# Altium schematic sheet LTC6803.SchDoc
size A; SheetNumber: 4
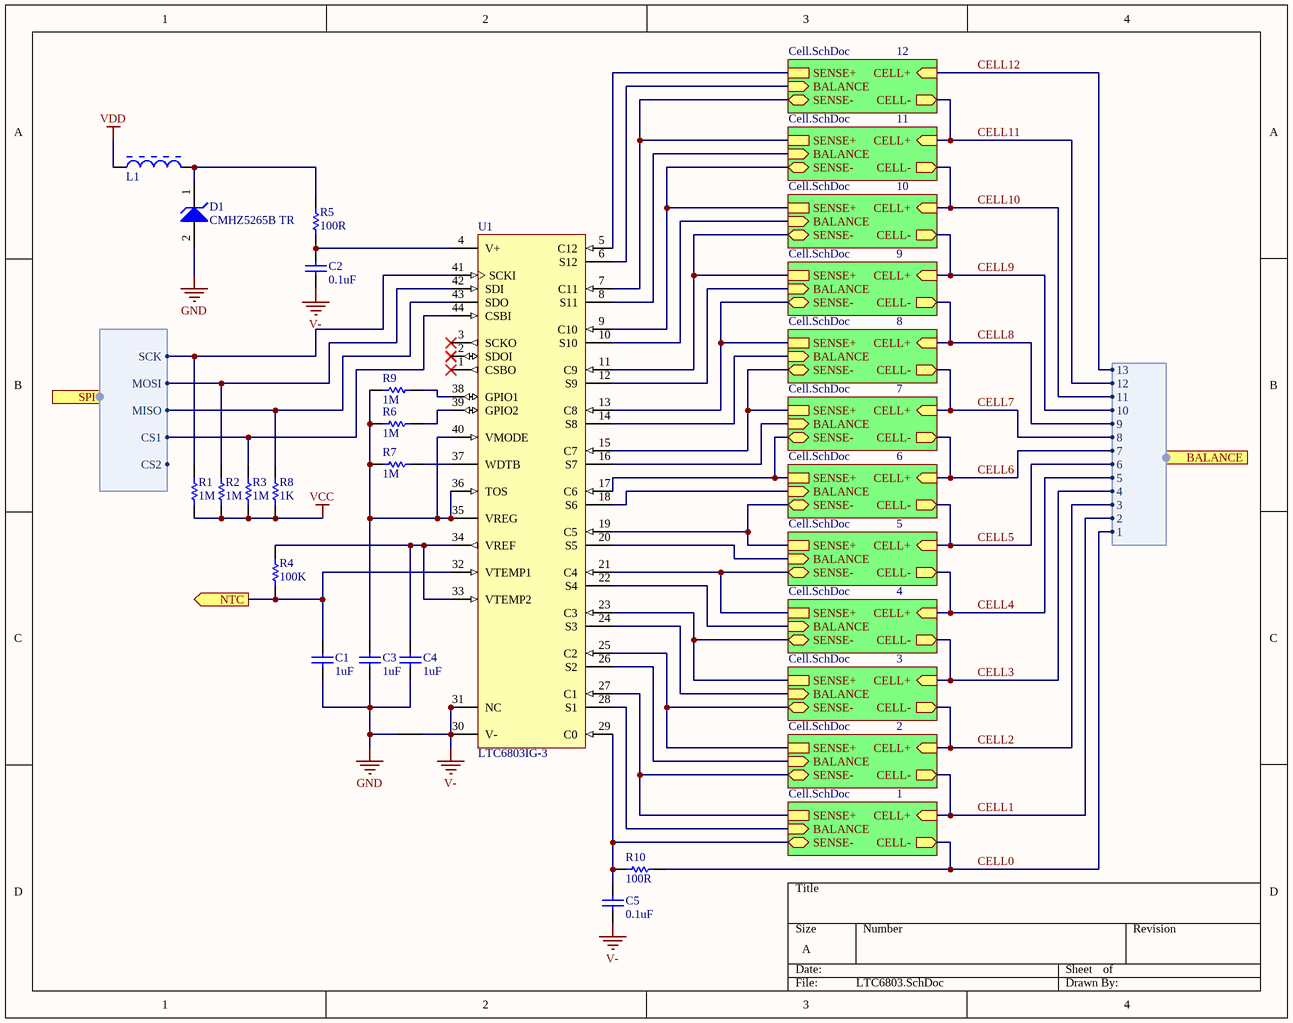
[diagram p0: LTC6803.SchDoc]

## Parts
*  NetTie  [NetTie]  (value not drawn)  (net tie, no BOM)
C1  value 1uF  [C0402[1005X55]]  (hidden comment: 1uF 6.3V 0402)
C2  value 0.1uF  [C0402[1005X55]]  (hidden comment: 0.1uF 100V 0402)
C3  value 1uF  [C0402[1005X55]]  (hidden comment: 1uF 6.3V 0402)
C4  value 1uF  [C0402[1005X55]]  (hidden comment: 1uF 6.3V 0402)
C5  value 0.1uF  [C0402[1005X55]]  (hidden comment: 0.1uF 6.3V 0402)
D1  CMHZ5265B TR  [SOD-123]
L1  MURA-FB-2  [MURA-BLM31-B60-CHIP-2_V3]  (value not drawn)
R1  value 1M  [R0402[1005]]  (hidden comment: 1M 1% 0402)
R2  value 1M  [R0402[1005]]  (hidden comment: 1M 1% 0402)
R3  value 1M  [R0402[1005]]  (hidden comment: 1M 1% 0402)
R4  value 100K  [R0402[1005]]  (hidden comment: 100K 1% 0402)
R5  value 100R  [R0402[1005]]  (hidden comment: 100R 1% 0402)
R6  value 1M  [R0402[1005]]  (hidden comment: 1M 1% 0402)
R7  value 1M  [R0402[1005]]  (hidden comment: 1M 1% 0402)
R8  value 1K  [R0402[1005]]  (hidden comment: 1K 1% 0402)
R9  value 1M  [R0402[1005]]  (hidden comment: 1M 1% 0402)
R10  value 100R  [R0402[1005]]  (hidden comment: 100R 1% 0402)
U1  LTC6803IG-3  [TSSOP-44]

## Sub-sheets
1 = Cell.SchDoc: SENSE+, SENSE- (bidir), BALANCE (in), CELL+ (in), CELL- (out)
2 = Cell.SchDoc: SENSE+, SENSE- (bidir), BALANCE (in), CELL+ (in), CELL- (out)
3 = Cell.SchDoc: SENSE+, SENSE- (bidir), BALANCE (in), CELL+ (in), CELL- (out)
4 = Cell.SchDoc: SENSE+, SENSE- (bidir), BALANCE (in), CELL+ (in), CELL- (out)
5 = Cell.SchDoc: SENSE+, SENSE- (bidir), BALANCE (in), CELL+ (in), CELL- (out)
6 = Cell.SchDoc: SENSE+, SENSE- (bidir), BALANCE (in), CELL+ (in), CELL- (out)
7 = Cell.SchDoc: SENSE+, SENSE- (bidir), BALANCE (in), CELL+ (in), CELL- (out)
8 = Cell.SchDoc: SENSE+, SENSE- (bidir), BALANCE (in), CELL+ (in), CELL- (out)
9 = Cell.SchDoc: SENSE+, SENSE- (bidir), BALANCE (in), CELL+ (in), CELL- (out)
10 = Cell.SchDoc: SENSE+, SENSE- (bidir), BALANCE (in), CELL+ (in), CELL- (out)
11 = Cell.SchDoc: SENSE+, SENSE- (bidir), BALANCE (in), CELL+ (in), CELL- (out)
12 = Cell.SchDoc: SENSE+, SENSE- (bidir), BALANCE (in), CELL+ (in), CELL- (out)

## Ports
BALANCE (harness Balance), NTC (out), SPI (harness SPI)

## Harnesses
SPI: SCK, MOSI, MISO, CS1, CS2
Balance: 13, 12, 11, 10, 9, 8, 6, 7, 5, 3, 4, 2, 1

## Nets
GND: *.1 C1.1 C3.1 C4.1 D1.2(A)
V-: *.2 C2.1 C5.1 U1.30(V-) U1.31(NC)
VCC: R1.1 R2.1 R3.1 R8.2
VDD: L1.1
CELL0: R10.2 ; sheet 1/CELL-, port BALANCE.1
CELL1: sheet 2/CELL-, sheet 1/CELL+, port BALANCE.2
CELL2: sheet 3/CELL-, sheet 2/CELL+, port BALANCE.3
CELL3: sheet 4/CELL-, sheet 3/CELL+, port BALANCE.4
CELL4: sheet 5/CELL-, sheet 4/CELL+, port BALANCE.5
CELL5: sheet 6/CELL-, sheet 5/CELL+, port BALANCE.6
CELL6: sheet 7/CELL-, sheet 6/CELL+, port BALANCE.7
CELL7: sheet 8/CELL-, sheet 7/CELL+, port BALANCE.8
CELL8: sheet 9/CELL-, sheet 8/CELL+, port BALANCE.9
CELL9: sheet 10/CELL-, sheet 9/CELL+, port BALANCE.10
CELL10: sheet 11/CELL-, sheet 10/CELL+, port BALANCE.11
CELL11: sheet 12/CELL-, sheet 11/CELL+, port BALANCE.12
CELL12: sheet 12/CELL+, port BALANCE.13
NTC: C1.2 R4.1 U1.32(VTEMP1) ; port NTC
NetC2_2: C2.2 R5.1 U1.4(V+)
NetC3_2: C3.2 R6.2 R7.2 R9.2 U1.35(VREG) U1.36(TOS) U1.40(VMODE)
NetC4_2: C4.2 R4.2 U1.33(VTEMP2) U1.34(VREF)
NetC5_2: C5.2 R10.1 U1.29(C0) ; sheet 1/SENSE-
NetD1_1: D1.1(K) L1.2 R5.2
NetR1_2: R1.2 U1.41(SCKI) ; port SPI.SCK
NetR2_2: R2.2 U1.42(SDI) ; port SPI.MOSI
NetR3_2: R3.2 U1.44(CSBI) ; port SPI.CS1
NetR6_1: R6.1 U1.39(GPIO2)
NetR7_1: R7.1 U1.37(WDTB)
NetR8_1: R8.1 U1.43(SDO) ; port SPI.MISO
NetR9_1: R9.1 U1.38(GPIO1)
NetU1_5: U1.5(C12) ; sheet 12/SENSE+
NetU1_6: U1.6(S12) ; sheet 12/BALANCE
NetU1_7: U1.7(C11) ; sheet 12/SENSE-, sheet 11/SENSE+
NetU1_8: U1.8(S11) ; sheet 11/BALANCE
NetU1_9: U1.9(C10) ; sheet 11/SENSE-, sheet 10/SENSE+
NetU1_10: U1.10(S10) ; sheet 10/BALANCE
NetU1_11: U1.11(C9) ; sheet 10/SENSE-, sheet 9/SENSE+
NetU1_12: U1.12(S9) ; sheet 9/BALANCE
NetU1_13: U1.13(C8) ; sheet 9/SENSE-, sheet 8/SENSE+
NetU1_14: U1.14(S8) ; sheet 8/BALANCE
NetU1_15: U1.15(C7) ; sheet 8/SENSE-, sheet 7/SENSE+
NetU1_16: U1.16(S7) ; sheet 7/BALANCE
NetU1_17: U1.17(C6) ; sheet 7/SENSE-, sheet 6/SENSE+
NetU1_18: U1.18(S6) ; sheet 6/BALANCE
NetU1_19: U1.19(C5) ; sheet 6/SENSE-, sheet 5/SENSE+
NetU1_20: U1.20(S5) ; sheet 5/BALANCE
NetU1_21: U1.21(C4) ; sheet 5/SENSE-, sheet 4/SENSE+
NetU1_22: U1.22(S4) ; sheet 4/BALANCE
NetU1_23: U1.23(C3) ; sheet 4/SENSE-, sheet 3/SENSE+
NetU1_24: U1.24(S3) ; sheet 3/BALANCE
NetU1_25: U1.25(C2) ; sheet 3/SENSE-, sheet 2/SENSE+
NetU1_26: U1.26(S2) ; sheet 2/BALANCE
NetU1_27: U1.27(C1) ; sheet 2/SENSE-, sheet 1/SENSE+
NetU1_28: U1.28(S1) ; sheet 1/BALANCE

Not connected (* = marked no-connect by the designer): U1 1(CSBO)* 2(SDOI)* 3(SCKO)*

## Library data of the parts
C1 C3 C4 = CAP_1uF_6.3V_0402_10%: 1uF 6.3V 10% 0402 (1005 Metric); PartNumber: GRM155R70J105KA12D; Manufacturer: Murata; Tolerance: 10%; Mounting Technology: Surface Mount; PackageReference: 0402; PackageDescription: 0402 (1005 Metric); Voltage: 6.3V
C2 = CAP_0.1uF_100V_0402_10%: 0.1uF 100V 10% 0402 (1005 Metric); PartNumber: GRM155R62A104KE14D; Manufacturer: Murata; Tolerance: 10%; Mounting Technology: Surface Mount; PackageReference: 0402; PackageDescription: 0402 (1005 Metric); Voltage: 100V
C5 = CAP_0.1uF_6.3V_0402_10%: 0.1uF 6.3V 10% 0402 (1005 Metric); PartNumber: GRM155R70J104KA01D; Manufacturer: Murata; Tolerance: 10%; Mounting Technology: Surface Mount; PackageReference: 0402; PackageDescription: 0402 (1005 Metric); Voltage: 6.3V
D1 = CMHZ5265B: Zener Diodes 500mW Zener Diode 185mA 58.9V to 2V; Manufacturer: Central Semiconductor; PartNumber: CMHZ5265B TR; Mounting Technology: Surface Mount; PackageReference: SOD-123; PackageDescription: SOD, 2-Leads, Body 2.69x1.6mm
L1 = MURA-FB-2: EMI Filter Beads, Chips & Arrays 1206 33 OHM; PartNumber: BLM31PG330SN1L; Manufacturer: Murata; Mounting Technology: Surface Mount; PackageReference: 1206; PackageDescription: 1206 (3216 Metric)
R1-R3 R6 R7 R9 = RES_1M_0402_1%: 1M 0.063W 1% 0402 (1005 Metric); Manufacturer: KOA Speer; PartNumber: RK73H1ETTP1004F; Power: 0.063W; Tolerance: 1%; Mounting Technology: Surface Mount; PackageReference: 0402; PackageDescription: 0402 (1005 Metric); ComponentLink1Description: Datasheet; ComponentLink1URL: http://www.koaspeer.com/catimages/Products/RK73H/RK73H.pdf
R4 = RES_100K_0402_1%: 100K 0.063W 1% 0402 (1005 Metric); Manufacturer: KOA Speer; PartNumber: RK73H1ETTP1003F; Power: 0.063W; Tolerance: 1%; Mounting Technology: Surface Mount; PackageReference: 0402; PackageDescription: 0402 (1005 Metric); ComponentLink1Description: Datasheet; ComponentLink1URL: http://www.koaspeer.com/catimages/Products/RK73H/RK73H.pdf
R5 R10 = RES_100R_0402_1%: 100R 0.063W 1% 0402 (1005 Metric); Manufacturer: KOA Speer; PartNumber: RK73H1ETTP1000F; Power: 0.063W; Tolerance: 1%; Mounting Technology: Surface Mount; PackageReference: 0402; PackageDescription: 0402 (1005 Metric); ComponentLink1Description: Datasheet; ComponentLink1URL: http://www.koaspeer.com/catimages/Products/RK73H/RK73H.pdf
R8 = RES_1K_0402_1%: 1K 0.063W 1% 0402 (1005 Metric); Manufacturer: KOA Speer; PartNumber: RK73H1ETTP1001F; Tolerance: 1%; Power: 0.063W; Mounting Technology: Surface Mount; PackageReference: 0402; PackageDescription: 0402 (1005 Metric); ComponentLink1Description: Datasheet; ComponentLink1URL: http://www.koaspeer.com/catimages/Products/RK73H/RK73H.pdf
U1 = LTC6803IG-3: PartNumber: LTC6803IG-3#PBF; Manufacturer: Linear Technology; PackageReference: TSSOP-44; Mounting Technology: Surface Mount; PackageDescription: SOP, 44-Leads, Body 13.1x5.6mm, Pitch 0.5mm